# EAGLE design Opticalpulsesensor1 (EAGLE 7.4.0)
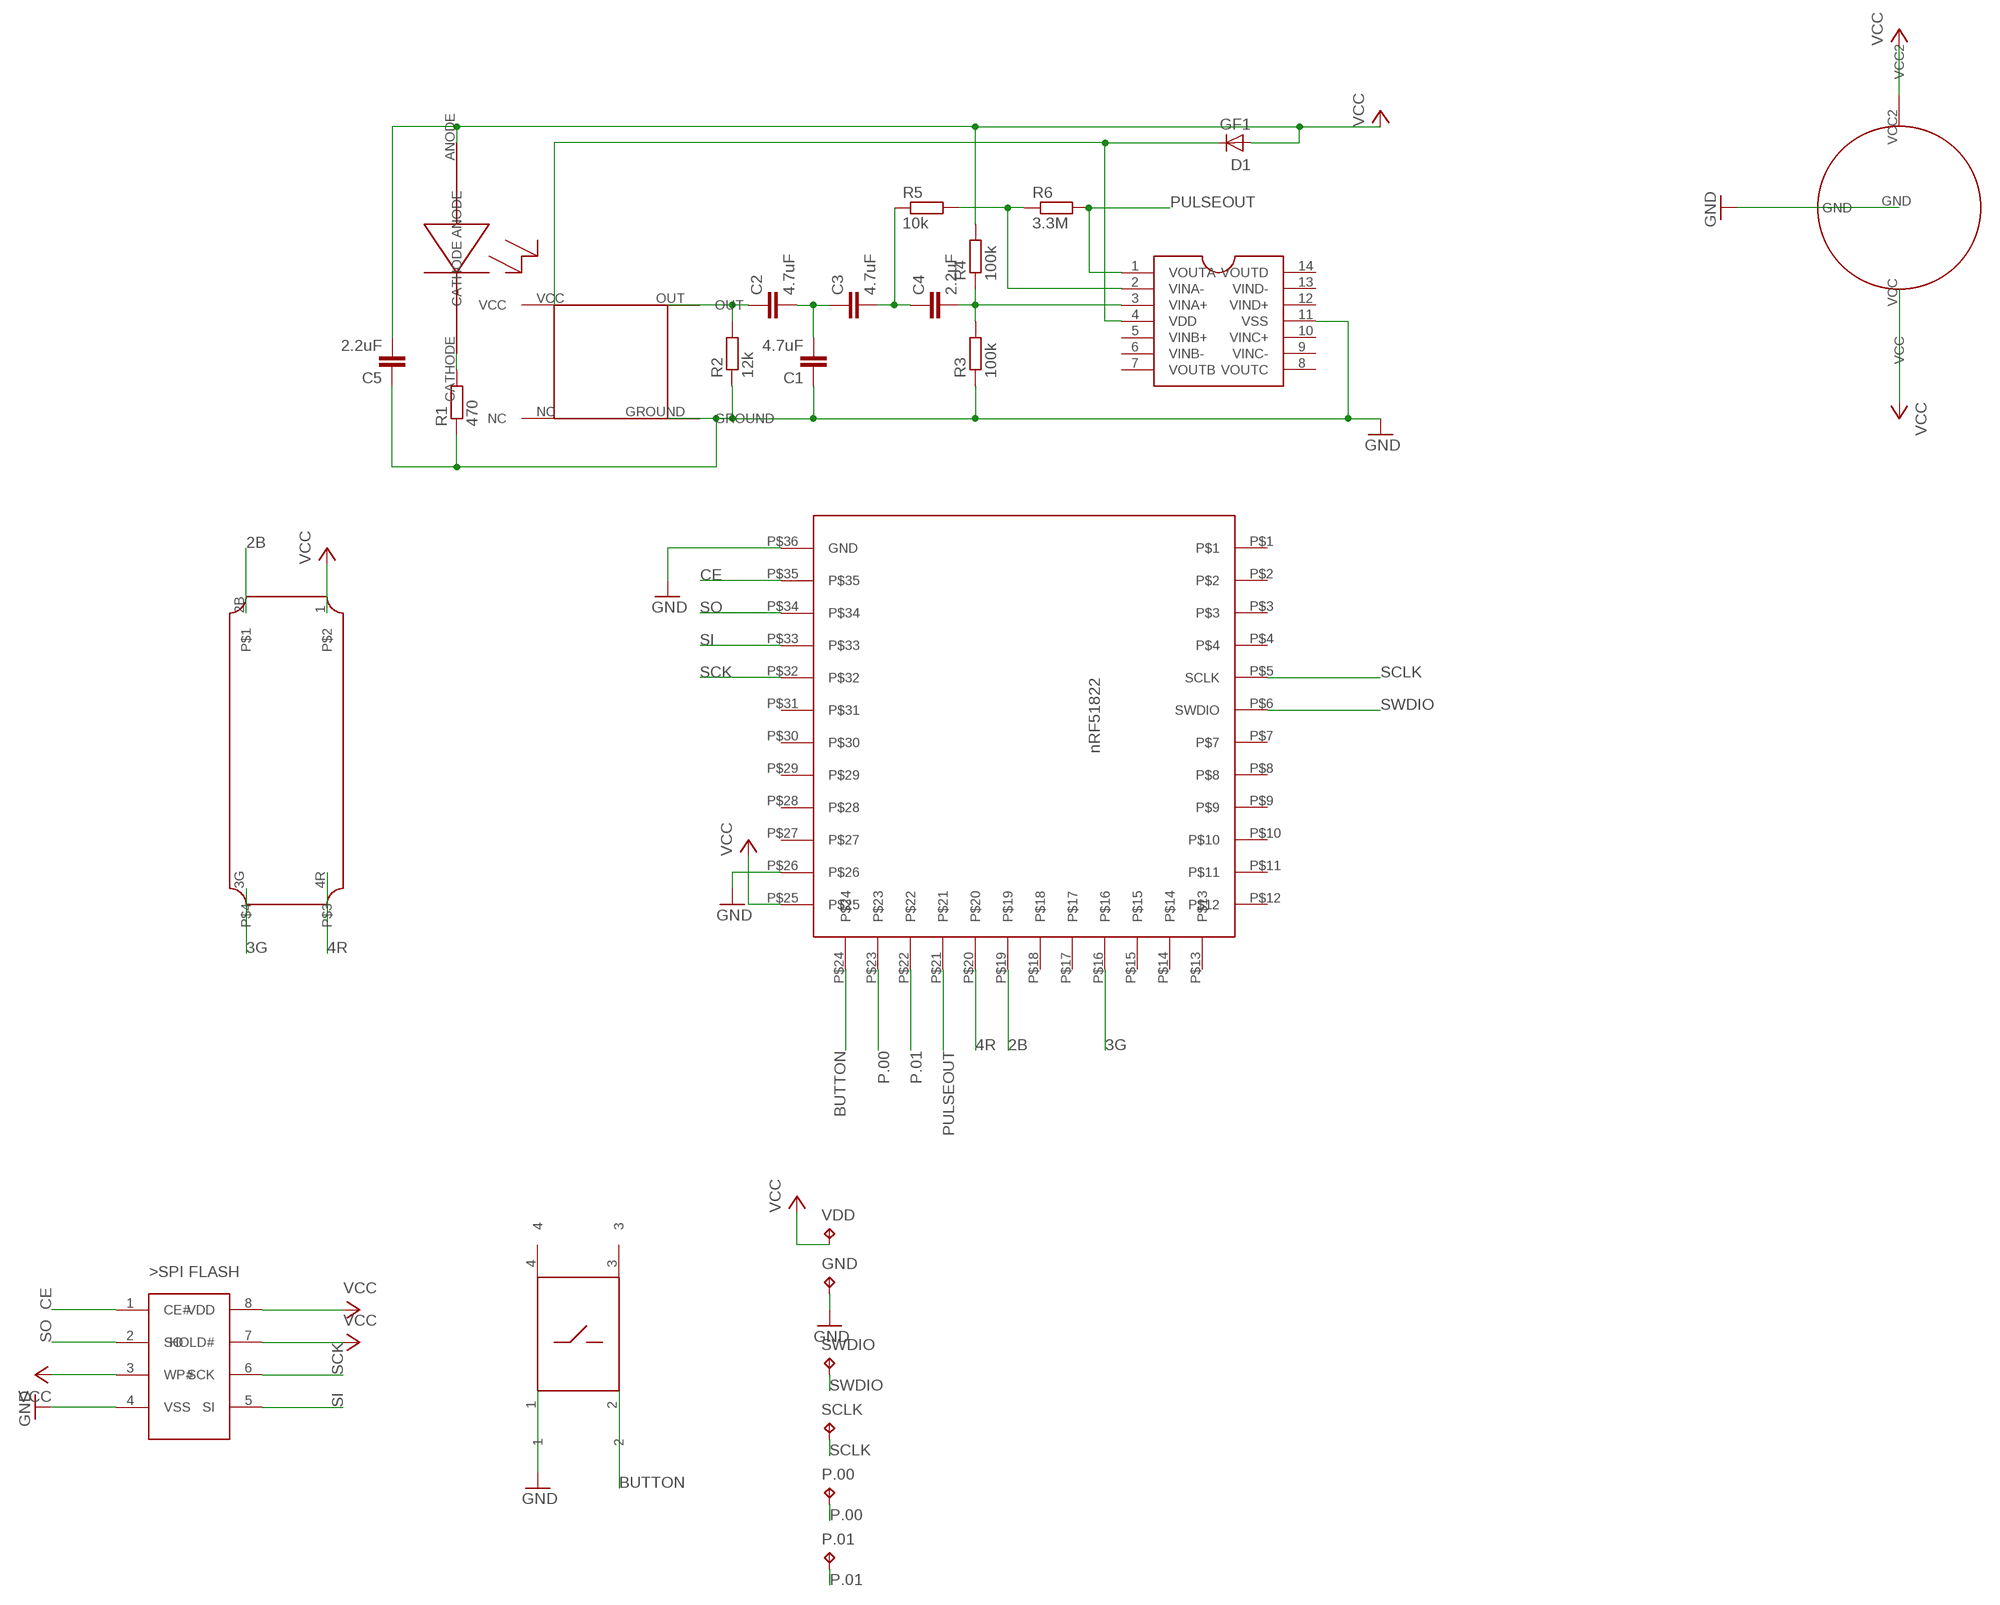
[diagram p0: schematic, sheet 1]

## Parts
C1  4.7uF  C-EUC0805  [C0805]
C2  4.7uF  C-EUC0805  [C0805]
C3  4.7uF  C-EUC0805  [C0805]
C4  2.2uF  C-EUC0805  [C0805]
C5  2.2uF  C-EUC0805  [C0805]
D1  GF1  [SMA-DO214AC]
GND  TPTP09SQ  [TP09SQ]
P.00  TPTP09SQ  [TP09SQ]
P.01  TPTP09SQ  [TP09SQ]
R1  470  R-EU_M0805  [M0805]
R2  12k  R-EU_M0805  [M0805]
R3  100k  R-EU_M0805  [M0805]
R4  100k  R-EU_M0805  [M0805]
R5  10k  R-EU_M0805  [M0805]
R6  3.3M  R-EU_M0805  [M0805]
SCLK  TPTP09SQ  [TP09SQ]
SWDIO  TPTP09SQ  [TP09SQ]
U$1  LIGHTSENSOR  [LIGHTSENSOR]
U$2  OPAMP  [TSSOP-14]
U$3  GREENLED  [GREENLED]
U$4  BATTERY  [BATTERY]
U$5  NRF51822  [NRF51822]
U$6  BUTTON1  [BUTTON1]
U$7  RGB  [RGB]
U$8  SPI_FLASH  [SOIC-8]
VDD  TPTP09SQ  [TP09SQ]

## Nets
2B: U$5.P$19 U$7.2B
3G: U$5.P$16 U$7.3G
4R: U$5.P$20
BUTTON: U$5.P$24 U$6.2
CE: U$5.P$35 U$8.1(CE#)
GND: C1.1 C5.1 GND.TP R1.1 R2.1 R3.1 U$1.GROUND U$2.11(VSS) U$4.GND U$5.P$26 U$5.P$36(GND) U$6.1 U$8.4(VSS)
N$2: C4.2 R3.2 R4.1 U$2.3(VINA+)
N$3: C3.2 C4.1 R5.1
N$4: D1.K(C) U$1.VCC U$2.4(VDD)
N$7: R5.2 R6.1 U$2.2(VINA-)
N$8: C1.2 C2.2 C3.1
N$9: C2.1 R2.2 U$1.OUT
N$10: R1.2 U$3.CATHODE
P.00: P.00.TP U$5.P$23
P.01: P.01.TP U$5.P$22
PULSEOUT: R6.2 U$2.1(VOUTA) U$5.P$21
SCK: U$5.P$32 U$8.6(SCK)
SCLK: SCLK.TP U$5.P$5(SCLK)
SI: U$5.P$33 U$8.5(SI)
SO: U$5.P$34 U$8.2(SO)
SWDIO: SWDIO.TP U$5.P$6(SWDIO)
VCC: C5.2 D1.A R4.2 U$3.ANODE U$4.VCC U$5.P$25 U$7.1 U$8.3(WP#) U$8.7(HOLD#) U$8.8(VDD) VDD.TP
Unconnected: U$1.NC U$2.5(VINB+) U$2.6(VINB-) U$2.7(VOUTB) U$2.8(VOUTC) U$2.9(VINC-) U$2.10(VINC+) U$2.12(VIND+) U$2.13(VIND-) U$2.14(VOUTD) U$4.VCC2 U$5.P$1 U$5.P$2 U$5.P$3 U$5.P$4 U$5.P$7 U$5.P$8 U$5.P$9 U$5.P$10 U$5.P$11 U$5.P$12 U$5.P$13 U$5.P$14 U$5.P$15 U$5.P$17 U$5.P$18 U$5.P$27 U$5.P$28 U$5.P$29 U$5.P$30 U$5.P$31 U$6.3 U$6.4 U$7.4R

## Library data of the parts
C1-C5 = rcl:C-EU: CAPACITOR, European symbol
D1 = diode:GF1: DIODE
GND P.00 P.01 SCLK SWDIO VDD = testpad:TP: Test pad
R1-R6 = rcl:R-EU_: RESISTOR, European symbol
U$1 = lightsensor:LIGHTSENSOR
U$2 = soic8:OPAMP
U$3 = GREENLED:GREENLED
U$4 = bat:BATTERY
U$5 = nrf51822:NRF51822
U$6 = button1:BUTTON1
U$7 = rgb:RGB
U$8 = soic8:SPI_FLASH

## Net classes
0 default: width 0.4 mm, drill 0.254 mm, clearance 0.254 mm

## Board
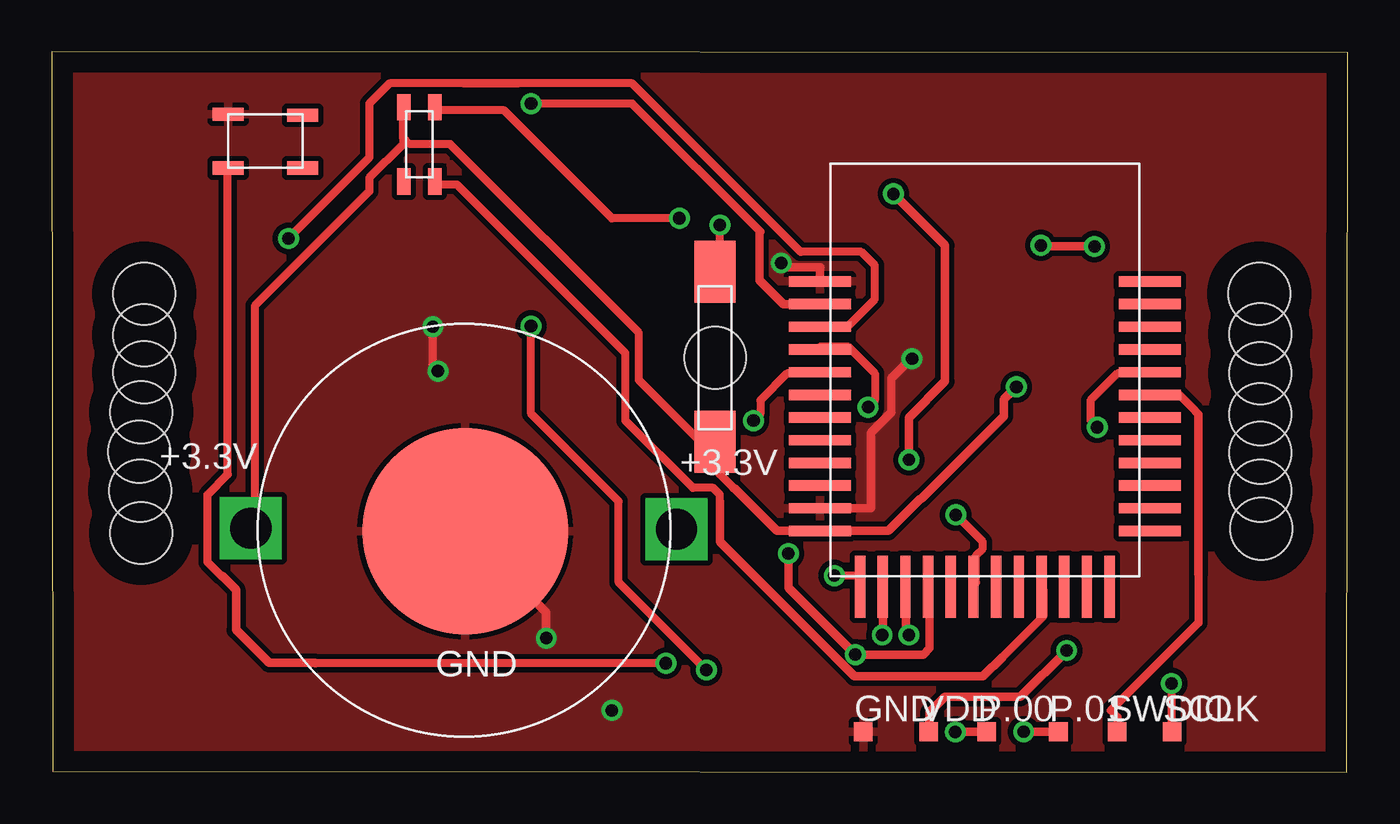
[diagram p1: board, top side]
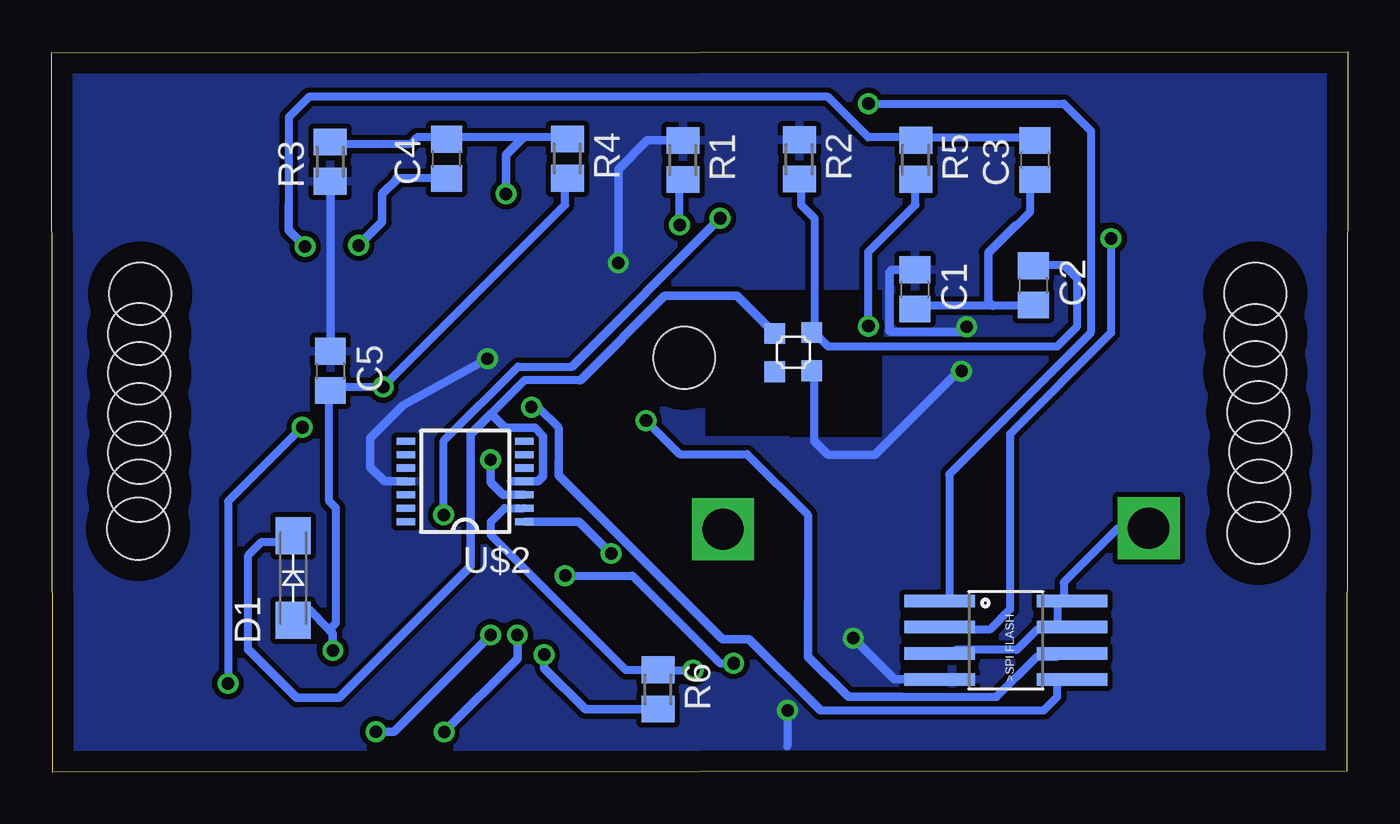
[diagram p2: board, bottom side, seen from below]

Size 62.9 x 34.95 mm. Coordinates in mm from the lower left corner, seen from the top.
Outline: 0.05,0.05 62.85,0 62.9,34.9 0,34.95 0.05,0.05
Copper layers (1*16): Top 0.035mm / dielectric 1.5mm / Bottom 0.035mm
Design rules "default *": minimum track width 10mil, minimum drill 24mil, track to track 10mil, track to pad 10mil, pad to pad 10mil, via to via 10mil, smd to smd 10mil, copper to edge 40mil, drill to drill 10mil, minimum pad ring 10mil, minimum via ring 8mil, stop-mask expansion 4mil, vias tented up to drill 0mil, thermal gap 10mil
Holes 3 mm at 32.2,20.1 4.5,23.2 4.5,21.2 4.5,19.4 4.35,17.45 4.25,15.55 4.3,13.65 4.35,11.6 58.6,23.2 58.65,21.25 58.65,19.35 58.65,17.35 58.65,15.5 58.65,13.65 58.7,11.8

### Footprints (pad centres in the part's own frame; a part is rotated, then mirrored left to right if it is on the bottom)
C0805 = smd 1.3 x 1.5: 1 -0.95,0; 2 0.95,0
SMA-DO214AC = smd 1.8 x 1.7: A -2.05,0; K 2.05,0
TP09SQ = smd 0.9 x 0.9: TP 0,0
M0805 = smd 1.3 x 1.6: 1 -0.95,0; 2 0.95,0
LIGHTSENSOR = smd 1 x 1: GROUND -0.15,-0.1; NC -0.2,1.7; OUT 1.7,-0.1; VCC 1.65,1.7
TSSOP-14 = smd 0.9 x 0.35: 1 -2.875,1.95; 2 -2.875,1.3; 3 -2.875,0.65; 4 -2.875,0; 5 -2.875,-0.65; 6 -2.875,-1.3; 7 -2.875,-1.95; 8 2.875,-1.95; 9 2.875,-1.3; 10 2.875,-0.65; 11 2.875,0; 12 2.875,0.65; 13 2.875,1.3; 14 2.875,1.95
GREENLED = smd 3 x 2: ANODE -0.6,0.8; CATHODE 7.65,0.8
BATTERY = smd 10 x 10: GND 0.05,-0.05 | drill 2 square: VCC -10.35,0.1; VCC2 10.3,0.05
NRF51822 = smd 0.5 x 3: P$1 -4.3,8; P$2 -3.2,8; P$3 -2.1,8; P$4 -1,8; P$5 0.1,8; P$6 1.2,8; P$7 2.3,8; P$8 3.4,8; P$9 4.5,8; P$10 5.6,8; P$11 6.7,8; P$12 7.8,8; P$25 7.8,-8; P$26 6.7,-8; P$27 5.6,-8; P$28 4.5,-8; P$29 3.4,-8; P$30 2.3,-8; P$31 1.2,-8; P$32 0.1,-8; P$33 -1,-8; P$34 -2.1,-8; P$35 -3.2,-8; P$36 -4.3,-8 | smd 3 x 0.5: P$13 10.5,6.05; P$14 10.5,4.95; P$15 10.5,3.85; P$16 10.5,2.75; P$17 10.5,1.65; P$18 10.5,0.55; P$19 10.5,-0.55; P$20 10.5,-1.65; P$21 10.5,-2.75; P$22 10.5,-3.85; P$23 10.5,-4.95; P$24 10.5,-6.05
BUTTON1 = smd 1.5 x 0.65: 1 0,2.6; 2 0,0; 3 3.6,0; 4 3.6,2.55
RGB = smd 1.27 x 0.66: 1 -0.2,-0.1; 2B -0.2,1.4; 3G 3.4,1.4; 4R 3.4,-0.1
SOIC-8 = smd 0.61 x 2.21: 1 -1.905,-2.616; 2 -0.635,-2.616; 3 0.635,-2.616; 4 1.905,-2.616; 5 1.905,2.616; 6 0.635,2.616; 7 -0.635,2.616; 8 -1.905,2.616 | smd 0.609 x 0.609: P$1 -1.904,4.015; P$2 -1.904,4.612; P$3 -0.636,4.015; P$4 -0.636,4.616; P$5 0.636,4.015; P$6 0.636,4.62; P$7 1.904,4.022; P$8 1.904,4.629; P$9 -1.902,-4.016; P$10 -1.902,-4.615; P$11 -0.636,-4.016; P$12 -0.636,-4.621; P$13 0.636,-4.016; P$14 0.636,-4.621; P$15 1.902,-4.016; P$16 1.902,-4.621

### Placement (x,y rotation side)
C1  21.02,23.41 270 bottom
C2  15.27,23.61 270 bottom
C3  15.18,29.69 90 bottom
C4  43.73,29.74 90 bottom
C5  49.37,19.46 270 bottom
D1  51.18,9.41 90 bottom
GND  39.39,1.96 0 top
P.00  45.38,1.96 0 top
P.01  48.85,1.96 0 top
R1  32.27,29.69 270 bottom
R2  26.62,29.72 270 bottom
R3  49.38,29.61 90 bottom
R4  37.87,29.76 270 bottom
R5  20.97,29.7 270 bottom
R6  33.47,4.01 270 bottom
SCLK  54.37,1.96 0 top
SWDIO  51.7,1.96 0 top
U$1  26.11,19.62 90 bottom
U$2  42.83,14.1 180 bottom
U$3  32.99,16.62 90 top
U$4  20.02,11.73 0 top
U$5  45.28,19.5 270 top
U$6  8.58,29.31 0 top
U$7  17.2,32.05 270 top
U$8  16.6,6.4 270 bottom
VDD  42.56,1.96 0 top

### Tracks (layer width: path | path; a pad name or v marks a point on that pad's centre or on a via)
2B  (via drill 0.61)
  Top 0.4: v30.46,26.86 27.19,26.86 21.96,32.1 18.69,32.1 U$7.2B | v43.87,12.48 45.18,11.17 45.18,10.84 44.85,10.51 44.85,9.21 U$5.P$19
  Bottom 0.4: 37.65,19.67 40.27,19.67 43.87,16.07 v43.87,12.48
  Bottom 0.406: v30.46,26.86 37.65,19.67
3G
  Top 0.4: 32.42,13.13 32.42,13.46 32.1,13.78 31.12,13.78 27.85,17.05 27.85,20.32 19.67,28.5 18.69,28.5 U$7.3G | 46.16,5.61 48.12,7.57 48.12,8.88 U$5.P$16
  Top 0.406: 32.42,13.13 32.42,11.18 38.95,4.65 45.2,4.65 46.16,5.61
BUTTON  (via drill 0.61)
  Top 0.4: 8.23,9.53 7.57,10.19 7.57,13.46 8.55,14.44 8.55,29.15 U$6.2 | v29.81,5.28 12.8,5.28 | v37.98,9.53 39.29,9.53 39.29,9.21 U$5.P$24
  Top 0.406: 8.23,9.53 8.27,9.53 8.95,8.85 8.95,6.9 10.55,5.3 12.79,5.3 12.8,5.28
  Bottom 0.4: v29.81,5.28 30.46,5.28 34.71,9.53 v37.98,9.53
CE  (via drill 0.61)
  Top 0.4: v23.27,32.42 28.17,32.42 34.38,26.21
  Top 0.406: U$5.P$35 35.5,22.7 34.35,23.85 34.35,26.18 34.38,26.21
  Bottom 0.4: v23.27,32.42 13.78,32.42 12.48,31.12 12.48,21.3 19.34,14.44 19.34,8.55 U$8.1
GND  (via drill 0.6, 0.61)
  Top 0.406: v24,6.5 24,7.75 U$4.GND | U$5.P$36 37.28,24.48 37.3,24.5 35.6,24.5 v35.4,24.7 | U$5.P$26 39.75,12.8 39.75,16.45 40.75,17.45 40.75,19.1 41.75,20.1 | v18.5,21.6 18.5,19.7 v18.75,19.45
  Bottom 0.4: 25.88,16.05 25.88,19.34 U$1.GROUND | v27.19,2.99 27.2,1.25
  Bottom 0.406: U$8.4 22,4.5 v24,6.5 | v35.4,24.7 35.4,29.25 34,30.65 R1.1 | C5.1 R3.1 | v41.75,20.05 45.85,17.8 47.45,16.2 47.45,14.8 46.75,14.1 U$2.11 | C1.1 22.14,24.36 22.25,24.25 22.25,21.4 22.2,21.35 18.75,21.35 v18.5,21.6 | v18.75,19.45 18.9,19.45 22.95,15.4 25.23,15.4 25.88,16.05
  pour Top: -0.05,34.95 62.9,34.95 62.9,0.05 -0.05,0.05
  pour Bottom: 0.05,34.85 62.85,34.85 62.85,0.05 27.2,0.05 27.2,16.1 31.4,16.1 31.4,23.6 22.4,23.6 22.4,16.05 26.9,16.05 26.9,0 0.05,0
N$2  (via drill 0.6)
  Top 0.406: v41.6,15.15 41.6,17.2 43.35,18.95 43.35,25.55 v40.85,28.05
  Bottom 0.4: R4.1 37.98,30.79 40,30.79 43.54,30.79 C4.2 43.87,30.79 45.18,30.79 45.5,30.46 49.1,30.46 R3.2
  Bottom 0.406: 40.85,13.45 U$2.3 41,13.45 41.6,14.05 v41.6,15.15 | v40.85,28.05 40.85,29.94 40,30.79
N$3  (via drill 0.6)
  Top 0.406: v48,25.55 48.05,25.5 v50.6,25.5
  Bottom 0.4: C3.2 15.42,30.79 20.65,30.79 R5.1 20.98,30.79 23.27,30.79 25.23,32.75 50.41,32.75 51.39,31.77 51.39,27.52 | 46.16,28.83 43.87,28.83 C4.1
  Bottom 0.406: 46.16,28.83 46.16,28.74 46.85,28.05 46.85,26.7 v48,25.55 | v50.6,25.5 51.39,26.29 51.39,27.52
N$4
  Bottom 0.4: 40.6,14.11 40.27,14.11 U$2.4 | 41.58,17.38 39.94,19.02 37.33,19.02 | 27.85,20.98 U$1.VCC | 53.35,5.94 53.35,10.51 52.7,11.17 51.39,11.17 D1.K
  Bottom 0.406: 40.6,14.11 39.29,14.11 39.05,14.35 39.05,16.3 39.45,16.7 40.9,16.7 41.58,17.38 42.56,16.4 42.56,9.99 48.95,3.6 51,3.6 53.34,5.94 53.35,5.94 | 37.33,19.02 37.23,19.02 33.15,23.1 29.64,23.1 U$1.VCC
N$7  (via drill 0.61)
  Top 0.4: v23.27,21.63 23.27,17.38 27.52,13.13 27.52,9.21 v31.77,4.96
  Bottom 0.4: U$2.2 40.27,12.8 40.92,12.8 41.58,12.15 41.58,11.5 35.04,4.96 33.73,4.96 R6.1 33.4,4.96 v31.77,4.96 | v23.27,21.63 23.27,25.23 20.98,27.52 20.98,28.5 R5.2
N$8
  Bottom 0.254: 15.3,22.55 C2.2
  Bottom 0.4: C1.2 20.98,22.61 17.25,22.61 15.42,22.61 C2.2 | 16.07,26.54 15.42,27.19 15.42,28.5 C3.1
  Bottom 0.406: 15.3,22.55 15.3,22.45 | 16.07,26.54 16.11,26.54 17.45,25.2 17.45,22.81 17.25,22.61
N$9
  Bottom 0.4: R2.2 26.54,28.5 26.54,27.52 25.88,26.86 25.88,21.63 U$1.OUT 25.88,21.3 25.23,20.65 14.11,20.65 13.13,21.63 13.13,23.92 13.78,24.57 15.09,24.57 C2.1
N$10  (via drill 0.61)
  Top 0.4: v32.42,26.54 32.42,24.57 U$3.CATHODE
  Bottom 0.4: v32.42,26.54 32.42,28.5 R1.2
P.00  (via drill 0.6)
  Top 0.406: U$5.P$23 40.33,6.68 v40.3,6.65 | v43.85,1.95 P.00.TP
  Bottom 0.406: v40.3,6.65 40.3,5.5 v43.85,1.95
P.01  (via drill 0.6)
  Top 0.406: P.01.TP v47.16,1.96 v47.15,1.95 | v41.6,6.65 41.45,6.8 41.45,8.98 U$5.P$22
  Bottom 0.406: v47.16,1.96 46.29,1.96 v41.6,6.65
PULSEOUT  (via drill 0.6)
  Top 0.4: 42.56,7.57 42.56,8.88 U$5.P$21
  Top 0.406: v35.75,10.6 35.75,8.95 v39,5.7 42.3,5.7 42.6,6 42.6,8.93 U$5.P$21
  Bottom 0.406: U$2.1 37.3,12.15 v35.75,10.6 | v39,5.7 39,5.05 37,3.05 R6.2
SCK  (via drill 0.61)
  Top 0.4: v34.06,17.05 34.38,17.38 34.38,18.04 35.69,19.34 37,19.34 U$5.P$32
  Bottom 0.4: 21.63,3.65 17.05,3.65 15.09,5.61 14.11,5.61 U$8.6 | 26.21,8.23 26.21,12.48 29.15,15.42 32.42,15.42 v34.06,17.05
  Bottom 0.406: 21.63,3.65 24.25,3.65 26.2,5.6 26.2,8.21 26.21,8.23
SCLK  (via drill 0.61)
  Top 0.4: v54.33,4.3 54.33,2.01 SCLK.TP | v50.73,16.73 50.41,17.05 50.41,18.04 51.72,19.34 53.02,19.34 U$5.P$5
  Bottom 0.4: v54.33,4.3 54.33,13.13 v50.73,16.73
SI  (via drill 0.61)
  Top 0.4: v39.62,17.71 39.94,18.04 39.94,19.34 38.64,20.65 37.33,20.65 U$5.P$33
  Bottom 0.4: 25.56,2.99 14.77,2.99 14.11,3.65 14.11,4.3 U$8.5 | 38.31,15.09 38.31,16.73 39.29,17.71 v39.62,17.71
  Bottom 0.406: 38.31,15.09 38.31,14.41 30.35,6.45 29.05,6.45 25.59,2.99 25.56,2.99
SO  (via drill 0.61)
  Top 0.4: v11.5,25.88 15.42,29.81 15.42,32.42 16.4,33.4 20,33.4 | 22.61,33.4 28.17,33.4 36.35,25.23 39.29,25.23 39.94,24.57 39.94,22.94 38.64,21.63 37.33,21.63 U$5.P$34
  Top 0.406: 20,33.4 22.61,33.4
  Bottom 0.4: v11.5,25.88 11.5,21.3 16.4,16.4 16.4,7.9 17.38,6.92 19.02,6.92 U$8.2
SWDIO
  Top 0.4: 55.64,10.51 55.64,9.6 55.64,7.24 51.39,2.99 51.72,2.67 51.72,2.01 SWDIO.TP | 55.31,17.71 54.66,18.36 53.35,18.36 U$5.P$6
  Top 0.406: 55.31,17.71 55.31,17.69 55.65,17.35 55.65,9.61 55.64,9.6
VCC  (via drill 0.6, 0.61)
  Top 0.4: 42.56,2.01 VDD.TP | 17.05,30.79 17.05,32.1 U$7.1 | 17.05,30.79 17.38,30.46 19.34,30.46 28.5,21.3 28.5,19.02 31.44,16.07 32.1,16.07 U$3.ANODE 32.42,15.75 32.42,14.44 33.08,13.78 | 17.05,30.79 17.05,30.46 15.42,28.83 15.42,28.17 9.86,22.61 9.86,12.15 U$4.VCC
  Top 0.406: v46.81,18.69 46.2,18.08 46.2,17.25 42.2,13.25 42.15,13.25 40.6,11.7 U$5.P$25 | 33.08,13.78 33.08,13.77 33.13,13.77 35.2,11.7 U$5.P$25 | 37.23,11.65 U$5.P$25 | v49.25,5.9 47,3.65 43.35,3.65 42.6,2.9 42.6,2 VDD.TP
  Bottom 0.4: D1.A 51.06,7.57 50.73,7.9 50.41,7.9 49.43,6.92 49.1,7.24 49.1,12.8 49.43,13.13 49.43,18.36 C5.2 49.1,18.69 v46.81,18.69 37.98,27.52 37.98,28.5 R4.2 | U$8.3 19.02,5.94 16.07,5.94 15.09,6.92 14.11,6.92 U$8.7 14.11,7.24 14.11,8.23 U$8.8 13.78,8.55 13.78,9.21 11.17,11.82 9.86,11.82 U$4.VCC
  Bottom 0.406: v49.25,5.9 49.25,6.74 49.43,6.92